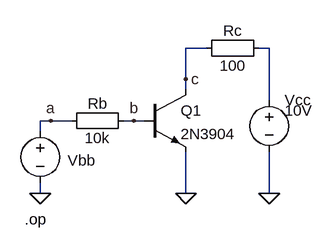
[diagram p0: schematic ce-switch-problem1.asc]
ce-switch-problem1.asc, the LTspice schematic file:
Version 4
SHEET 1 880 680
WIRE 240 16 208 16
WIRE 336 16 320 16
WIRE 208 64 208 16
WIRE 208 80 208 64
WIRE 336 96 336 16
WIRE 0 128 -16 128
WIRE 32 128 0 128
WIRE 128 128 112 128
WIRE 144 128 128 128
WIRE -16 144 -16 128
WIRE -16 240 -16 224
WIRE 208 240 208 176
WIRE 336 240 336 176
FLAG 208 240 0
FLAG -16 240 0
FLAG 336 240 0
FLAG 0 128 a
FLAG 128 128 b
FLAG 208 64 c
SYMBOL Misc\\EuropeanResistor 336 0 R90
WINDOW 0 5 56 VBottom 2
WINDOW 3 27 56 VTop 2
SYMATTR InstName Rc
SYMATTR Value 100
SYMBOL Misc\\EuropeanResistor 128 112 R90
WINDOW 0 5 56 VBottom 2
WINDOW 3 27 56 VTop 2
SYMATTR InstName Rb
SYMATTR Value 10k
SYMBOL voltage -16 128 R0
WINDOW 3 42 77 Left 2
WINDOW 123 0 0 Left 2
WINDOW 39 0 0 Left 2
WINDOW 0 42 61 Left 2
SYMATTR Value ""
SYMATTR InstName Vbb
SYMBOL voltage 336 80 R0
WINDOW 3 24 32 Left 2
WINDOW 123 0 0 Left 2
WINDOW 39 0 0 Left 2
SYMATTR Value 10V
SYMATTR InstName Vcc
SYMBOL npn 144 80 R0
SYMATTR InstName Q1
SYMATTR Value 2N3904
TEXT -40 280 Left 2 !.op

The netlist it stands for:
* ce-switch-problem1.asc
Rc N001 c 100
Rb b a 10k
Vbb a 0
Vcc N001 0 10V
Q1 c b 0 0 2N3904
.model NPN NPN
.model PNP PNP
.lib standard.bjt
.op
.backanno
.end